# Altium schematic sheet SD.SchDoc
size A4
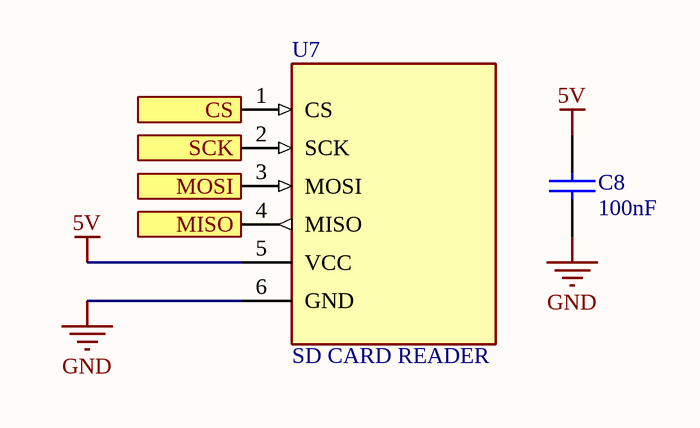
[diagram p0: SD.SchDoc]

## Parts
C8  100nF  [0805]
U7  SD CARD READER  [SD CARD]

## Ports
CS (in), MISO (out), MOSI (in), SCK (in)

## Nets
5V: C8.1 U7.5(VCC)
GND: C8.2 U7.6(GND)
CS: U7.1(CS) ; port CS
MISO: U7.4(MISO) ; port MISO
MOSI: U7.3(MOSI) ; port MOSI
SCK: U7.2(SCK) ; port SCK

## Library data of the parts
C8 = CAP
U7 = SD_CARD